# Altium schematic sheet 10_Connectors.SchDoc
size A3; SheetNumber: 10; SheetTotal: 10
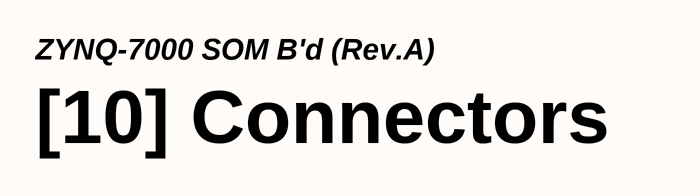
[diagram p0: 10_Connectors.SchDoc]

## Notes on the sheet
- ZYNQ-7000 SOM B'd (Rev.A)
- [10] Connectors
- Title
- Rev
- Doc
- Sheet #
- of
- Author
- This document is copyright of ArkX and shall not be revealed, produced, copied, in whole or in part,
- Date
- nor used for any purpose other than submitted.